# EAGLE design Bed Temp Controller (EAGLE 7.7.0)

## Sheet 1 of 2
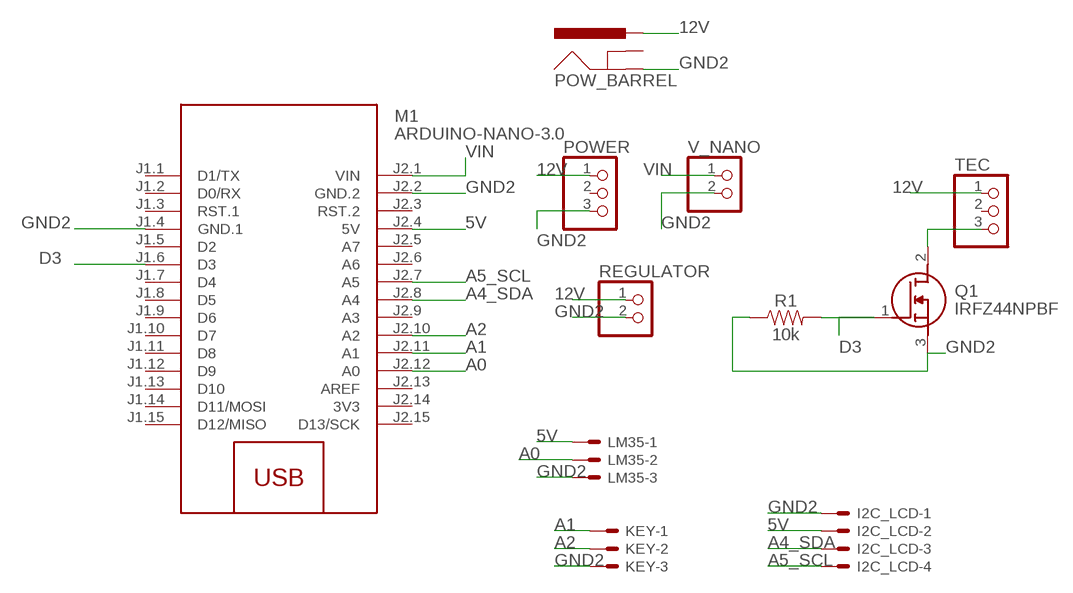
[diagram p0: schematic, sheet 1]

### Parts
I2C_LCD  JST-XH-04-PIN-ROUND-PAD  [JST-XH-04-PACKAGE-ROUND-PAD]
KEY  JST-XH-03-PIN-ROUND-PAD  [JST-XH-03-PACKAGE-ROUND-PAD]
LM35  JST-XH-03-PIN-ROUND-PAD  [JST-XH-03-PACKAGE-ROUND-PAD]
M1  ARDUINO-NANO-3.0  [ARDUINO-NANO-3.0]
POW_BARREL  POWER_JACKPTH_BREAD  [POWER_JACK_PTH_BREAD]
POWER  PINHD-1X3  [1X03]
Q1  IRFZ44NPBF  [TO254P483X1016X1994-3P]
R1  10k  1KOHM-HORIZ-1/4W-1%  [AXIAL-0.3]
REGULATOR  PINHD-1X2  [1X02]
TEC  PINHD-1X3  [1X03]
V_NANO  PINHD-1X2  [1X02]

### Nets
5V: I2C_LCD.2 LM35.1 M1.J2.4(5V)
12V: POW_BARREL.PWR POWER.1 REGULATOR.1 TEC.1
A0: LM35.2 M1.J2.12(A0)
A1: KEY.1 M1.J2.11(A1)
A2: KEY.2 M1.J2.10(A2)
A4_SDA: I2C_LCD.3 M1.J2.8(A4)
A5_SCL: I2C_LCD.4 M1.J2.7(A5)
D3: M1.J1.6(D3) Q1.1(G) R1.P$2
D-TEC: Q1.2(D) TEC.3
GND2: I2C_LCD.1 KEY.3 LM35.3 M1.J1.4(GND.1) M1.J2.2(GND.2) POW_BARREL.GND POWER.3 Q1.3(S) R1.P$1 REGULATOR.2 V_NANO.2
VIN: M1.J2.1(VIN) V_NANO.1
Unconnected: M1.J1.1(D1/TX) M1.J1.2(D0/RX) M1.J1.3(RST.1) M1.J1.5(D2) M1.J1.7(D4) M1.J1.8(D5) M1.J1.9(D6) M1.J1.10(D7) M1.J1.11(D8) M1.J1.12(D9) M1.J1.13(D10) M1.J1.14(D11/MOSI) M1.J1.15(D12/MISO) M1.J2.3(RST.2) M1.J2.5(A7) M1.J2.6(A6) M1.J2.9(A3) M1.J2.13(AREF) M1.J2.15(D13/SCK) POW_BARREL.GNDBREAK POWER.2 TEC.2

## Sheet 2 of 2

## Power pins joined to a net without a drawn wire
3V3: M1.J2.14(3V3)

## Library data of the parts
I2C_LCD = Rembrandt Electronics - JST XH Connectors v1-0:JST-XH-04-PIN: JST XH Connector 2 Pin Wire to board connector. Pitch: 2,54 mm, (0.100") Number of pins: 4 Created by Rembrandt Electronics www.rembrandtelectronics.com
KEY LM35 = Rembrandt Electronics - JST XH Connectors v1-0:JST-XH-03-PIN: JST XH Connector 2 Pin Wire to board connector. Pitch: 2,54 mm, (0.100") Number of pins: 3 Created by Rembrandt Electronics www.rembrandtelectronics.com
M1 = diy-modules:ARDUINO-NANO-3.0: Arduino Nano 3.0 and compatible devices More details available here: https://www.arduino.cc/en/Main/ArduinoBoardNano Click here to find device on ebay.com <http://www.ebay.com/sch/arduino+nano>
POW_BARREL = SparkFun-Connectors:POWER_JACK: Power Jack Connector This is the standard 5.5mm barrel jack for power. The PTH is the most common, proven, reliable, footprint. The Slot footprint only works if the mill layer is transmitted to the PCB fab house so be warned. Here are the connectors we sell at SparkFun: DC Barrel Power Jack/Connector <https://www.sparkfun.com/products/119> (PRT-00119) DC Barrel Power Jack/Connector (SMD) <https://www.sparkfun.com/products/12748> (PRT-12748) DC Barrel Jack Adapter - Breadboard Compatible <https://www.sparkfun.com/products/10811> (PRT-10811) It is used on this SparkFun product (and many, many others): SparkFun RedBoard - Programmed with Arduino <https://www.sparkfun.com/products/12757> (DEV-12757) Also, if you need a mating power supply or connector, please check these out: Wall Adapter Power Supply - 9VDC 650mA <https://www.sparkfun.com/products/298> (TOL-00298) DC Barrel Jack Adapter - Male <https://www.sparkfun.com/products/10287> (PRT-10287); PROD_ID: PRT-10811
POWER TEC = pinhead_1x14_no_frame MOD:PINHD-1X3: PIN HEADER
Q1 = IRFZ44NPBF:IRFZ44NPBF: MOSFET N-Channel 55V 49A TO220AB Infineon IRFZ44NPBF N-channel MOSFET Transistor, 49 A, 55 V, 3-Pin TO-220AB Source: Datasheet <https://www.arrow.com/en/products/irfz44npbf/infineon-technologies-ag>; ARROW_PART_NUMBER: IRFZ44NPBF; DESCRIPTION: MOSFET N-Channel 55V 49A TO220AB Infineon IRFZ44NPBF N-channel MOSFET Transistor, 49 A, 55 V, 3-Pin TO-220AB; HEIGHT: 4.83mm; MANUFACTURER_NAME: Infineon; MANUFACTURER_PART_NUMBER: IRFZ44NPBF
R1 = SparkFun-Resistors:1KOHM: 1kΩ resistor A resistor is a passive two-terminal electrical component that implements electrical resistance as a circuit element. Resistors act to reduce current flow, and, at the same time, act to lower voltage levels within circuits. - Wikipedia; PROD_ID: RES-12182; VALUE: 1k
REGULATOR V_NANO = pinhead:PINHD-1X2: PIN HEADER

## Board
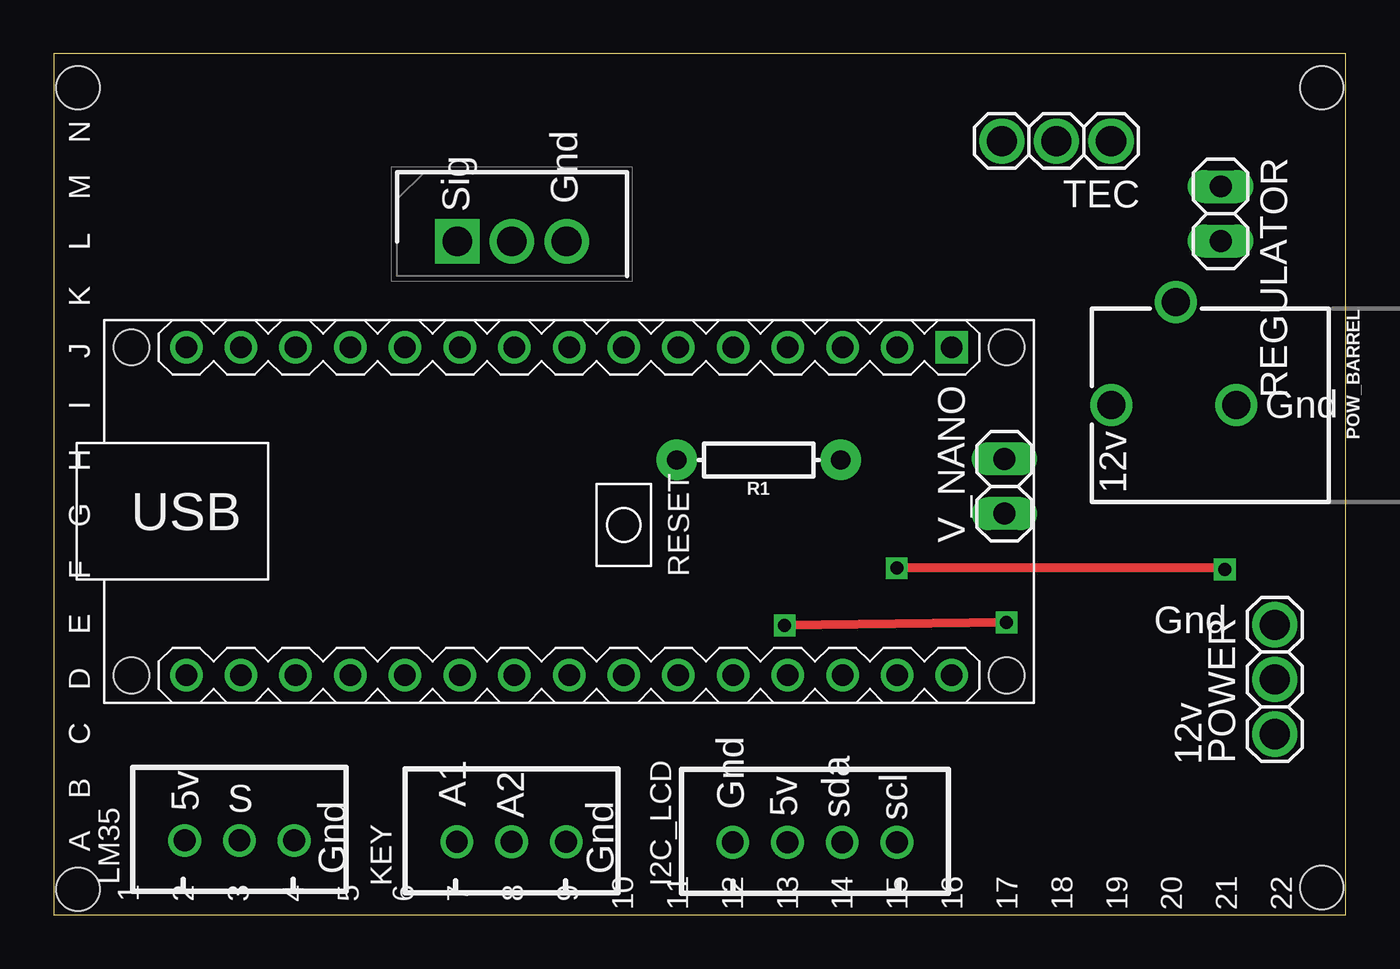
[diagram p1: board, top side]
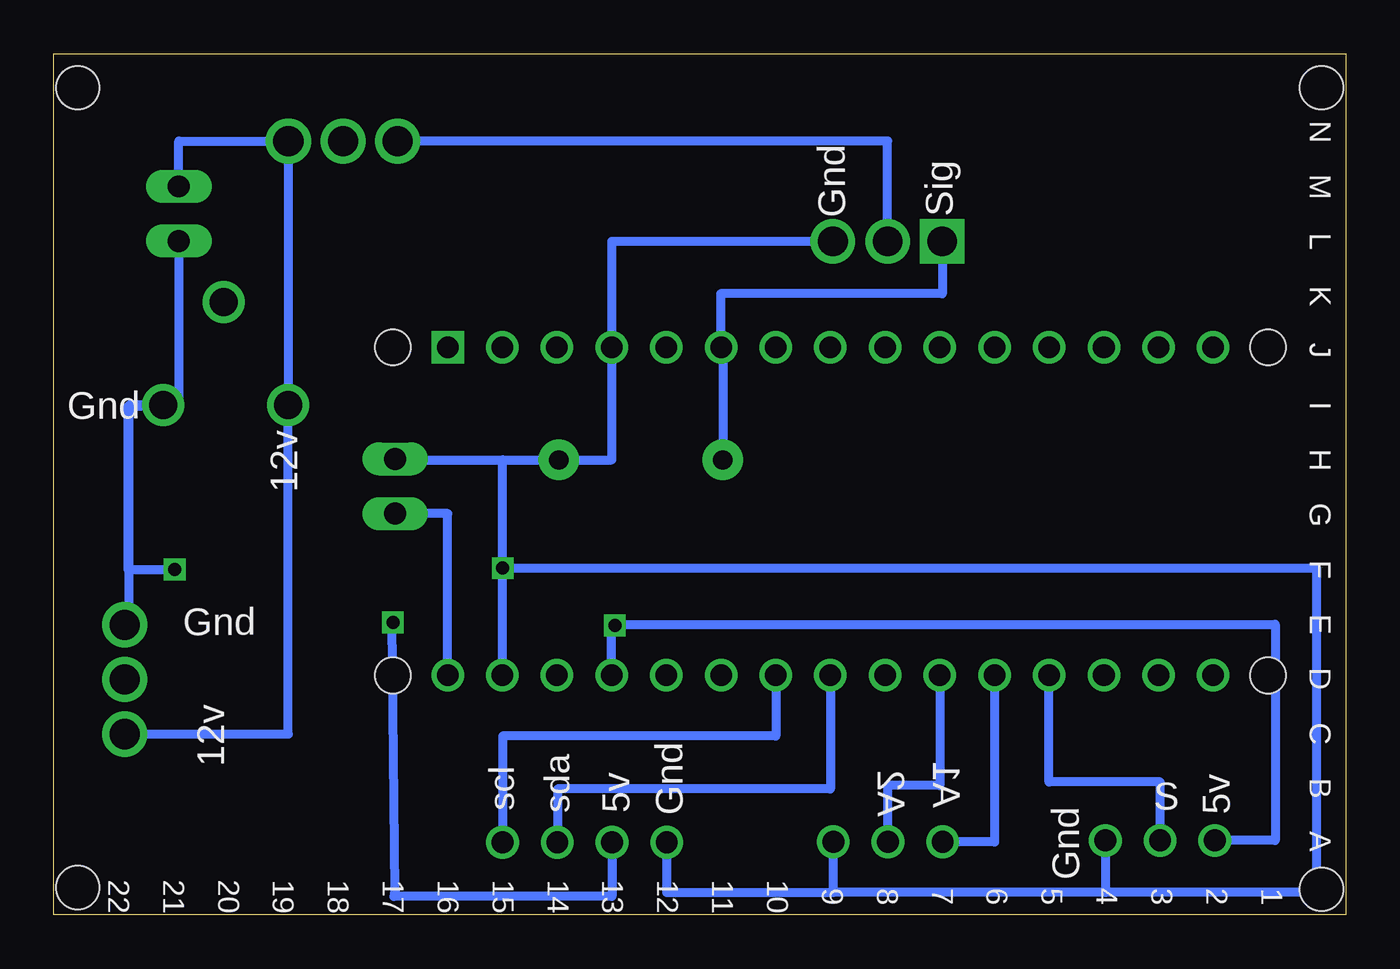
[diagram p2: board, bottom side, seen from below]

Size 60 x 40 mm. Coordinates in mm from the lower left corner, seen from the top.
Outline: 0,0 60,0 60,40 0,40 0,0
Copper layers (1*16): Top 0.035mm / dielectric 1.5mm / Bottom 0.035mm
Design rules "default": minimum track width 10mil, minimum drill 24mil, track to track 8mil, track to pad 8mil, pad to pad 8mil, via to via 8mil, smd to smd 8mil, copper to edge 40mil, drill to drill 8mil, minimum pad ring 10mil, minimum via ring 8mil, stop-mask expansion 4mil, vias tented up to drill 0mil, thermal gap 10mil
Holes 2 mm at 58.89,1.27 58.89,38.43 1.12,1.19 1.12,38.43

### Footprints (pad centres in the part's own frame; a part is rotated, then mirrored left to right if it is on the bottom)
JST-XH-04-PACKAGE-ROUND-PAD = drill 1.016: 1 -3.81,0; 2 -1.27,0; 3 1.27,0; 4 3.81,0
JST-XH-03-PACKAGE-ROUND-PAD = drill 1.016: 1 -2.54,0; 2 0,0; 3 2.54,0
ARDUINO-NANO-3.0 = drill 1 square: J1.1 17.78,7.62 | drill 1: J1.2 15.24,7.62; J1.3 12.7,7.62; J1.4 10.16,7.62; J1.5 7.62,7.62; J1.6 5.08,7.62; J1.7 2.54,7.62; J1.8 0,7.62; J1.9 -2.54,7.62; J1.10 -5.08,7.62; J1.11 -7.62,7.62; J1.12 -10.16,7.62; J1.13 -12.7,7.62; J1.14 -15.24,7.62; J1.15 -17.78,7.62; J2.1 17.78,-7.62; J2.2 15.24,-7.62; J2.3 12.7,-7.62; J2.4 10.16,-7.62; J2.5 7.62,-7.62; J2.6 5.08,-7.62; J2.7 2.54,-7.62; J2.8 0,-7.62; J2.9 -2.54,-7.62; J2.10 -5.08,-7.62; J2.11 -7.62,-7.62; J2.12 -10.16,-7.62; J2.13 -12.7,-7.62; J2.14 -15.24,-7.62; J2.15 -17.78,-7.62 | hole 1.651: -20.32,7.62; -20.32,-7.62; 20.32,-7.62; 20.32,7.62
POWER_JACK_PTH_BREAD = drill 1.3: GND 0,7.9; GNDBREAK 4.8,10.7; PWR 0,13.7
1X03 = drill 1.397: 1 -2.54,0; 2 0,0; 3 2.54,0
TO254P483X1016X1994-3P = drill 1.38 pad 2.07 square: 1 0,0 | drill 1.38 pad 2.07: 2 2.54,0; 3 5.08,0
AXIAL-0.3 = drill 0.9 pad 1.88: P$1 -3.81,0; P$2 3.81,0
1X02 = drill 1.016 long: 1 -1.27,0; 2 1.27,0

### Placement (x,y rotation side)
I2C_LCD  35.34,3.37 0 top
KEY  21.26,3.39 0 top
LM35  8.62,3.46 0 top
M1  23.93,18.75 0 top
POW_BARREL  62.81,23.67 90 top
POWER  56.71,10.94 90 top
Q1  18.74,31.28 0 top
R1  32.74,21.13 180 top
REGULATOR  54.19,32.57 270 top
TEC  46.57,35.95 180 top
U$1  [1X14]  3.54,19.86 90 top
U$2  [1X14]  6.08,19.86 90 top
U$3  [1X14]  8.62,19.86 90 top
U$4  [1X14]  11.16,19.86 90 top
U$5  [1X14]  13.7,19.86 90 top
U$6  [1X14]  16.24,19.86 90 top
U$7  [1X14]  18.78,19.86 90 top
U$8  [1X14]  21.32,19.86 90 top
U$9  [1X14]  23.86,19.86 90 top
U$10  [1X14]  26.4,19.86 90 top
U$11  [1X14]  28.94,19.86 90 top
U$12  [1X14]  31.48,19.86 90 top
U$13  [1X14]  34.02,19.86 90 top
U$14  [1X14]  36.56,19.86 90 top
U$15  [1X14]  39.1,19.86 90 top
U$16  [1X14]  41.64,19.86 90 top
U$17  [1X14]  44.18,19.86 90 top
U$18  [1X14]  46.72,19.86 90 top
U$19  [1X14]  49.26,19.86 90 top
U$20  [1X14]  51.8,19.86 90 top
U$21  [1X14]  54.34,19.86 90 top
U$22  [1X14]  56.88,19.86 90 top
V_NANO  44.15,19.91 90 top

### Tracks (layer width: path | path; a pad name or v marks a point on that pad's centre or on a via)
5V  (via drill 0.6)
  Top 0.406: v44.25,13.58 v33.94,13.45
  Bottom 0.406: M1.J2.4 34.09,13.5 | 34.09,13.5 3.28,13.5 3.28,3.46 LM35.1 | I2C_LCD.2 34.08,0.86 44.2,0.86 44.2,0.85 44.14,1.1 44.29,13.58 v44.25,13.58 | v33.94,13.45 34.04,13.46 34.09,13.5
12V
  Bottom 0.406: POWER.1 49.11,8.4 POW_BARREL.PWR TEC.1 54.19,35.95 REGULATOR.1
A0
  Bottom 0.406: LM35.2 8.62,6.18 13.78,6.18 M1.J2.12
A1
  Bottom 0.406: M1.J2.11 16.31,3.39 KEY.1
A2
  Bottom 0.406: M1.J2.10 18.85,6.01 21.27,6.01 21.27,3.39 KEY.2
A4_SDA
  Bottom 0.406: M1.J2.8 23.93,5.85 36.6,5.85 36.6,3.37 I2C_LCD.3
A5_SCL
  Bottom 0.406: M1.J2.7 26.47,8.31 39.15,8.31 I2C_LCD.4
D3
  Bottom 0.406: R1.P$2 28.93,26.37 M1.J1.6 29.03,26.37 29.03,28.86 18.74,28.86 Q1.1
D-TEC
  Bottom 0.406: Q1.2 21.28,35.95 TEC.3
GND2  (via drill 0.6)
  Top 0.406: v54.39,16.05 54.39,16.11 v39.15,16.11
  Bottom 0.406: 11.16,3.37 LM35.3 11.16,1.05 | Q1.3 34.09,31.29 M1.J1.4 34.09,21.13 R1.P$1 39.15,21.13 | M1.J2.2 39.15,11.13 v39.15,16.11 | v39.15,16.11 39.15,21.13 | 23.8,3.37 KEY.3 23.8,1.05 | 11.16,1.05 23.8,1.05 | I2C_LCD.1 31.54,1.05 23.8,1.05 | v39.15,16.11 1.36,16.11 1.36,1.05 11.16,1.05 | POW_BARREL.GND 56.52,23.67 56.52,13 56.71,13 POWER.3 | POW_BARREL.GND 54.91,23.62 56.56,23.62 56.56,16.05 v54.39,16.05 | REGULATOR.2 54.19,23.67 POW_BARREL.GND | V_NANO.2 44.15,21.13 39.15,21.13
VIN
  Bottom 0.406: M1.J2.1 41.71,18.64 V_NANO.1

### Text on the board
tNames: N | M | Sig | Gnd | L | K | J | I | Gnd | H | 12v | G | F | E | Gnd | D | C | sda | scl | 12v | B | 5v | 5v | S | A1 | A2 | Gnd | A | Gnd | Gnd | 1 / 2 / 3 / 4 / 5 / 6 / 7 / 8 / 9 / 10 / 11 / 12 / 13 / 14 / 15 / 16 / 17 / 18 / 19 / 20 / 21 / 22
bNames: N | Gnd | Sig | M | L | K | J | I | Gnd | H | 12v | G | F | E | Gnd | D | C | Gnd | 5v | sda | 12v | B | S | Gnd | A1 | A2 | 5v | scl | A | 1 / 2 / 3 / 4 / 5 / 6 / 7 / 8 / 9 / 10 / 11 / 12 / 13 / 14 / 15 / 16 / 17 / 18 / 19 / 20 / 21 / 22